# EAGLE design Esquematico (EAGLE 9.6.2)
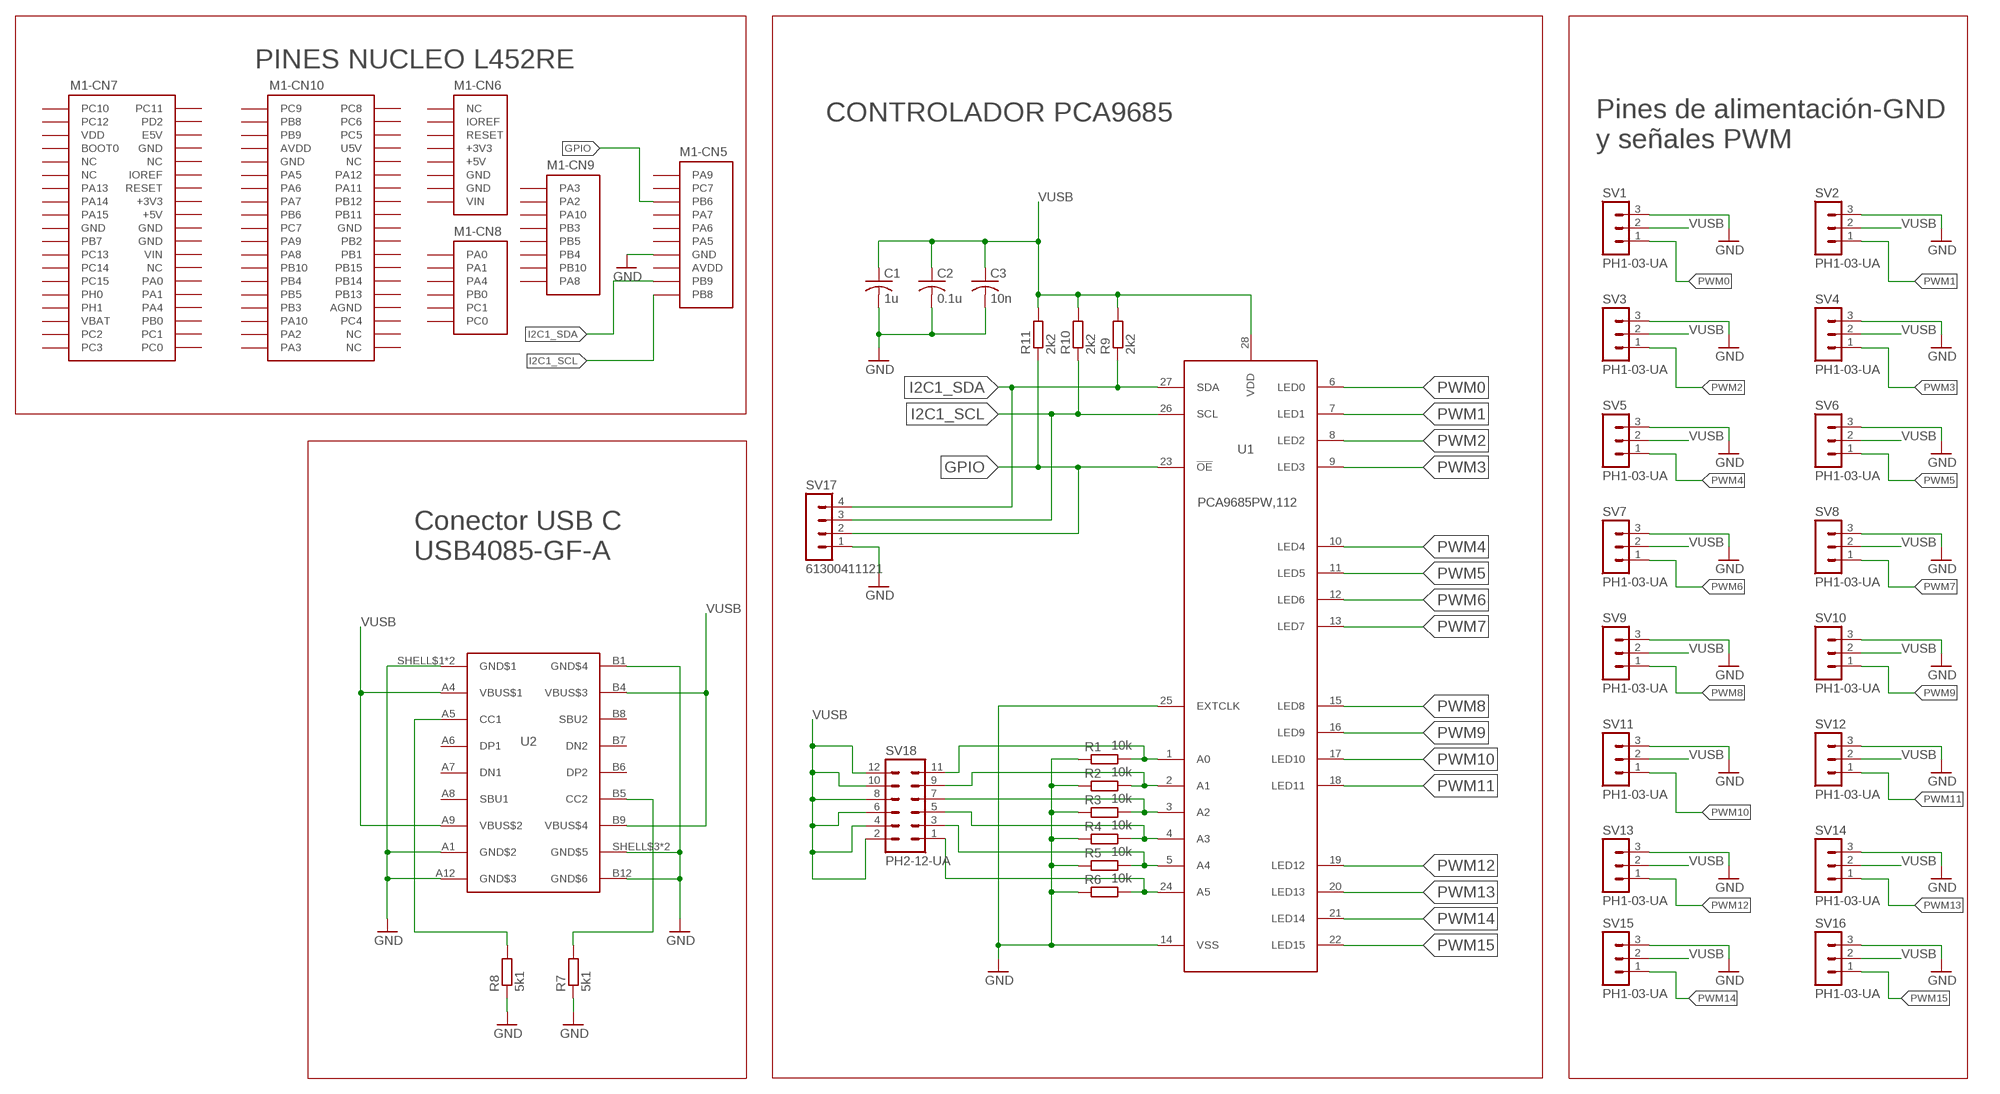
[diagram p0: schematic, sheet 1]

## Parts
C1  1u  C-USC1206  [C1206]
C2  0.1u  C-USC0805  [C0805]
C3  10n  C-USC0603  [C0603]
M1  NUCLEO-L452RE  [NUCLEO-64]
R1  10k  R-EU_R0805  [R0805]
R2  10k  R-EU_R0805  [R0805]
R3  10k  R-EU_R0805  [R0805]
R4  10k  R-EU_R0805  [R0805]
R5  10k  R-EU_R0805  [R0805]
R6  10k  R-EU_R0805  [R0805]
R7  5k1  R-EU_R0805  [R0805]
R8  5k1  R-EU_R0805  [R0805]
R9  2k2  R-EU_R0805  [R0805]
R10  2k2  R-EU_R0805  [R0805]
R11  2k2  R-EU_R0805  [R0805]
SV1  PH1-03-UA  MA03-1  [MA03-1]
SV2  PH1-03-UA  MA03-1  [MA03-1]
SV3  PH1-03-UA  MA03-1  [MA03-1]
SV4  PH1-03-UA  MA03-1  [MA03-1]
SV5  PH1-03-UA  MA03-1  [MA03-1]
SV6  PH1-03-UA  MA03-1  [MA03-1]
SV7  PH1-03-UA  MA03-1  [MA03-1]
SV8  PH1-03-UA  MA03-1  [MA03-1]
SV9  PH1-03-UA  MA03-1  [MA03-1]
SV10  PH1-03-UA  MA03-1  [MA03-1]
SV11  PH1-03-UA  MA03-1  [MA03-1]
SV12  PH1-03-UA  MA03-1  [MA03-1]
SV13  PH1-03-UA  MA03-1  [MA03-1]
SV14  PH1-03-UA  MA03-1  [MA03-1]
SV15  PH1-03-UA  MA03-1  [MA03-1]
SV16  PH1-03-UA  MA03-1  [MA03-1]
SV17  61300411121  MA04-1  [MA04-1]
SV18  PH2-12-UA  MA06-2  [MA06-2]
U1  PCA9685PW,112  [SOP65P640X110-28N]
U2  USB4085-GF-A  [TROUGH_HOLE]

## Nets
GND: C1.2 C2.2 C3.2 M1.CN5-7(-CN5:GND) R1.1 R2.1 R3.1 R4.1 R5.1 R6.1 R7.1 R8.1 SV1.3 SV2.3 SV3.3 SV4.3 SV5.3 SV6.3 SV7.3 SV8.3 SV9.3 SV10.3 SV11.3 SV12.3 SV13.3 SV14.3 SV15.3 SV16.3 SV17.1 U1.14(VSS) U1.25(EXTCLK) U2.A1(GND$2) U2.A12(GND$3) U2.B1(GND$4) U2.B12(GND$6) U2.SHELL$1(GND$1) U2.SHELL$2(GND$1) U2.SHELL$3(GND$5) U2.SHELL$4(GND$5)
GPIO: M1.CN5-3(-CN5:PB6) R11.1 SV17.2 U1.23(!OE)
I2C1_SCL: M1.CN5-10(-CN5:PB8) R10.1 SV17.3 U1.26(SCL)
I2C1_SDA: M1.CN5-9(-CN5:PB9) R9.1 SV17.4 U1.27(SDA)
N$1: R1.2 SV18.11 U1.1(A0)
N$2: R2.2 SV18.9 U1.2(A1)
N$3: R3.2 SV18.7 U1.3(A2)
N$4: R4.2 SV18.5 U1.4(A3)
N$5: R5.2 SV18.3 U1.5(A4)
N$6: R6.2 SV18.1 U1.24(A5)
N$7: R8.2 U2.A5(CC1)
N$9: R7.2 U2.B5(CC2)
PWM0: SV1.1 U1.6(LED0)
PWM1: SV2.1 U1.7(LED1)
PWM2: SV3.1 U1.8(LED2)
PWM3: SV4.1 U1.9(LED3)
PWM4: SV5.1 U1.10(LED4)
PWM5: SV6.1 U1.11(LED5)
PWM6: SV7.1 U1.12(LED6)
PWM7: SV8.1 U1.13(LED7)
PWM8: SV9.1 U1.15(LED8)
PWM9: SV10.1 U1.16(LED9)
PWM10: SV11.1 U1.17(LED10)
PWM11: SV12.1 U1.18(LED11)
PWM12: SV13.1 U1.19(LED12)
PWM13: SV14.1 U1.20(LED13)
PWM14: SV15.1 U1.21(LED14)
PWM15: SV16.1 U1.22(LED15)
VUSB: C1.1 C2.1 C3.1 R9.2 R10.2 R11.2 SV1.2 SV2.2 SV3.2 SV4.2 SV5.2 SV6.2 SV7.2 SV8.2 SV9.2 SV10.2 SV11.2 SV12.2 SV13.2 SV14.2 SV15.2 SV16.2 SV18.2 SV18.4 SV18.6 SV18.8 SV18.10 SV18.12 U1.28(VDD) U2.A4(VBUS$1) U2.A9(VBUS$2) U2.B4(VBUS$3) U2.B9(VBUS$4)
Unconnected: M1.CN5-1(-CN5:PA9) M1.CN5-2(-CN5:PC7) M1.CN5-4(-CN5:PA7) M1.CN5-5(-CN5:PA6) M1.CN5-6(-CN5:PA5) M1.CN6-1(-CN6:NC) M1.CN6-3(-CN6:RESET) M1.CN7-1(-CN7:PC10) M1.CN7-2(-CN7:PC11) M1.CN7-3(-CN7:PC12) M1.CN7-4(-CN7:PD2) M1.CN7-6(-CN7:E5V) M1.CN7-7(-CN7:BOOT0) M1.CN7-9(-CN7:NC) M1.CN7-10(-CN7:NC) M1.CN7-11(-CN7:NC) M1.CN7-12(-CN7:IOREF) M1.CN7-13(-CN7:PA13) M1.CN7-14(-CN7:RESET) M1.CN7-15(-CN7:PA14) M1.CN7-17(-CN7:PA15) M1.CN7-21(-CN7:PB7) M1.CN7-23(-CN7:PC13) M1.CN7-25(-CN7:PC14) M1.CN7-26(-CN7:NC) M1.CN7-27(-CN7:PC15) M1.CN7-28(-CN7:PA0) M1.CN7-29(-CN7:PH0) M1.CN7-30(-CN7:PA1) M1.CN7-31(-CN7:PH1) M1.CN7-32(-CN7:PA4) M1.CN7-34(-CN7:PB0) M1.CN7-35(-CN7:PC2) M1.CN7-36(-CN7:PC1) M1.CN7-37(-CN7:PC3) M1.CN7-38(-CN7:PC0) M1.CN8-1(-CN8:PA0) M1.CN8-2(-CN8:PA1) M1.CN8-3(-CN8:PA4) M1.CN8-4(-CN8:PB0) M1.CN8-5(-CN8:PC1) M1.CN8-6(-CN8:PC0) M1.CN9-1(-CN9:PA3) M1.CN9-2(-CN9:PA2) M1.CN9-3(-CN9:PA10) M1.CN9-4(-CN9:PB3) M1.CN9-5(-CN9:PB5) M1.CN9-6(-CN9:PB4) M1.CN9-7(-CN9:PB10) M1.CN9-8(-CN9:PA8) M1.CN10-1(-CN10:PC9) M1.CN10-2(-CN10:PC8) M1.CN10-3(-CN10:PB8) M1.CN10-4(-CN10:PC6) M1.CN10-5(-CN10:PB9) M1.CN10-6(-CN10:PC5) M1.CN10-10(-CN10:NC) M1.CN10-11(-CN10:PA5) M1.CN10-12(-CN10:PA12) M1.CN10-13(-CN10:PA6) M1.CN10-14(-CN10:PA11) M1.CN10-15(-CN10:PA7) M1.CN10-16(-CN10:PB12) M1.CN10-17(-CN10:PB6) M1.CN10-18(-CN10:PB11) M1.CN10-19(-CN10:PC7) M1.CN10-21(-CN10:PA9) M1.CN10-22(-CN10:PB2) M1.CN10-23(-CN10:PA8) M1.CN10-24(-CN10:PB1) M1.CN10-25(-CN10:PB10) M1.CN10-26(-CN10:PB15) M1.CN10-27(-CN10:PB4) M1.CN10-28(-CN10:PB14) M1.CN10-29(-CN10:PB5) M1.CN10-30(-CN10:PB13) M1.CN10-31(-CN10:PB3) M1.CN10-33(-CN10:PA10) M1.CN10-34(-CN10:PC4) M1.CN10-35(-CN10:PA2) M1.CN10-36(-CN10:NC) M1.CN10-37(-CN10:PA3) M1.CN10-38(-CN10:NC) U2.A6(DP1) U2.A7(DN1) U2.A8(SBU1) U2.B6(DP2) U2.B7(DN2) U2.B8(SBU2)

## Notes on the sheet
- PINES NUCLEO L452RE
- CONTROLADOR PCA9685
- Pines de alimentación-GND
  y señales PWM
- Conector USB C
  USB4085-GF-A

## Power pins joined to a net without a drawn wire
+3V3: M1.CN6-4(-CN6:+3V3) M1.CN7-16(-CN7:+3V3)
+5V: M1.CN6-5(-CN6:+5V) M1.CN7-18(-CN7:+5V)
AGND: M1.CN10-32(-CN10:AGND)
AVDD: M1.CN5-8(-CN5:AVDD) M1.CN10-7(-CN10:AVDD)
GND: M1.CN6-6(-CN6:GND) M1.CN6-7(-CN6:GND) M1.CN7-8(-CN7:GND) M1.CN7-19(-CN7:GND) M1.CN7-20(-CN7:GND) M1.CN7-22(-CN7:GND) M1.CN10-9(-CN10:GND) M1.CN10-20(-CN10:GND)
IOREF: M1.CN6-2(-CN6:IOREF)
U5V: M1.CN10-8(-CN10:U5V)
VBAT: M1.CN7-33(-CN7:VBAT)
VDD: M1.CN7-5(-CN7:VDD)
VIN: M1.CN6-8(-CN6:VIN) M1.CN7-24(-CN7:VIN)

## Library data of the parts
C1 = rcl:C-US: CAPACITOR, American symbol; PARTNO: 490-5810-1-ND; SPICEPREFIX: C
C2 = rcl:C-US: CAPACITOR, American symbol; PARTNO: 490-GCJ21BR72A104KA01KCT-ND; SPICEPREFIX: C
C3 = rcl:C-US: CAPACITOR, American symbol; PARTNO: 490-4781-1-ND; SPICEPREFIX: C
M1 = NUCLEO-L452RE:NUCLEO-L452RE: No existe un outline (Layer Dimension) para esta librería. En su lugar se utilizó una referencia en tDocu. Al momento de diseñar la tarjeta, el Dimension debe ser dibujado según los requerimientos del usuario, o simplemente copiar los contenidos del tDocu en Dimensions.; PARTNO: NUCLEO-L452RE
R1-R6 = rcl:R-EU_: RESISTOR, European symbol; PARTNO: 311-10KARCT-ND; SPICEPREFIX: R
R7 R8 = rcl:R-EU_: RESISTOR, European symbol; PARTNO: 311-5.10KCRCT-ND; SPICEPREFIX: R
R9-R11 = rcl:R-EU_: RESISTOR, European symbol; PARTNO: 311-2.2KARCT-ND; SPICEPREFIX: R
SV1-SV16 = con-lstb:MA03-1: PIN HEADER; OC_FARNELL: unknown; OC_NEWARK: unknown; PARTNO: PH1-03-UA
SV17 = con-lstb:MA04-1: PIN HEADER; OC_FARNELL: unknown; OC_NEWARK: unknown; PARTNO: 61300411121
SV18 = con-lstb:MA06-2: PIN HEADER; OC_FARNELL: unknown; OC_NEWARK: unknown; PARTNO: PH2-12-UA
U1 = PCA9685PW,112 - NXP USA Inc:PCA9685PW,112; PARTNO: PCA9685PW,112
U2 = USB4085-GF-A:USB4085-GF-A; PARTNO: 2073-USB4085-GF-ACT-ND

## Board
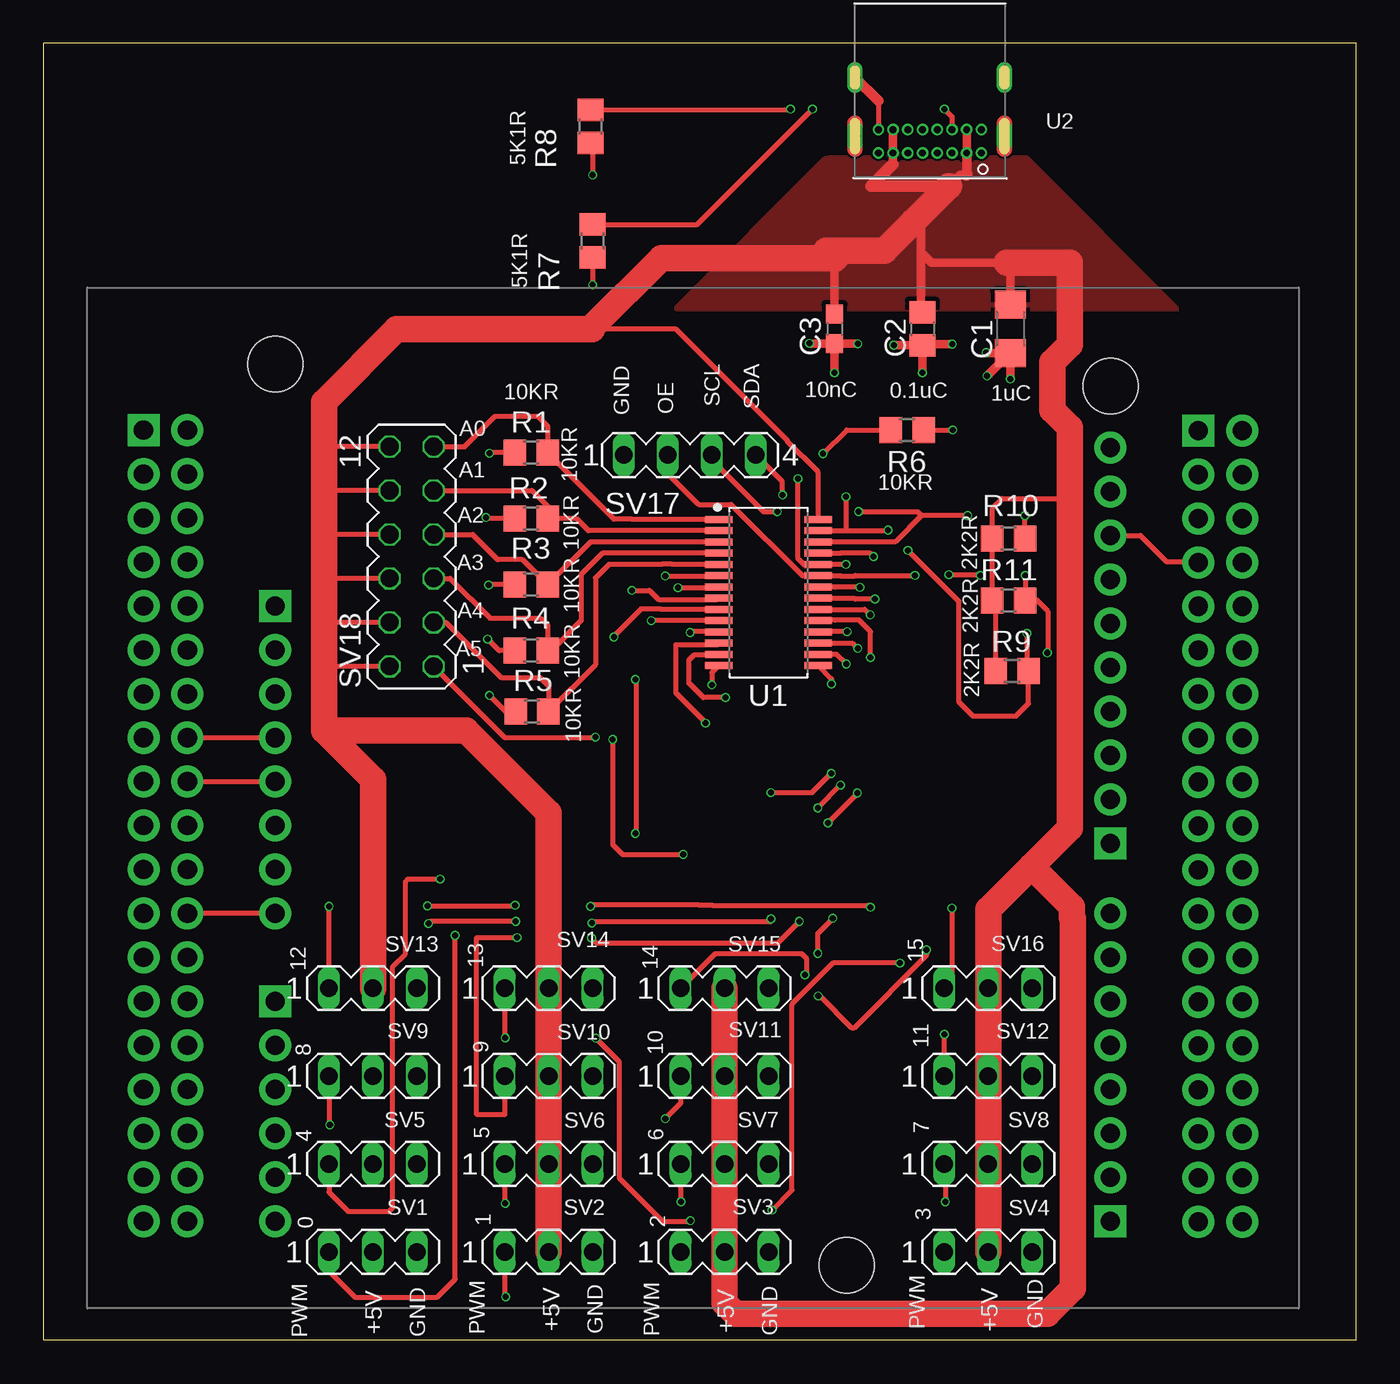
[diagram p1: board, top side]
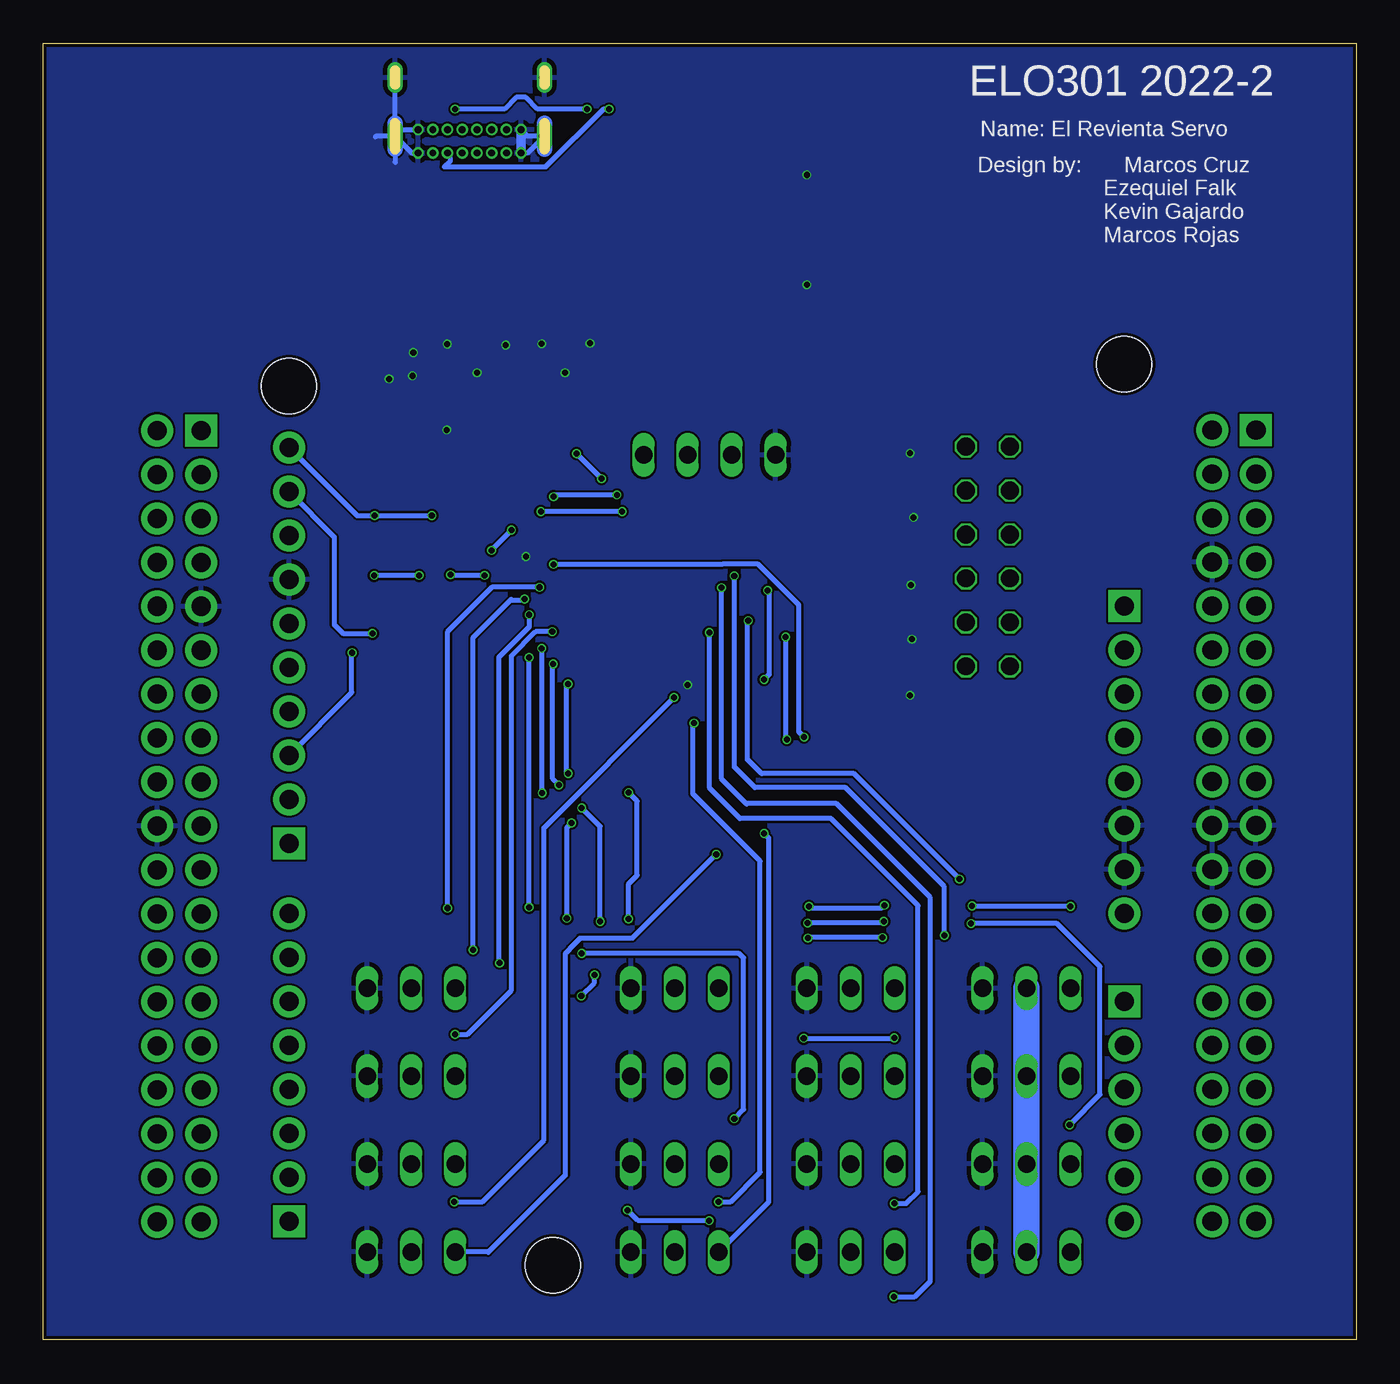
[diagram p2: board, bottom side, seen from below]

Size 75.87 x 74.92 mm. Coordinates in mm from the lower left corner, seen from the top.
Outline: 0,0 75.87,0 75.87,74.92 0,74.92 0,0
Copper layers (1*16): Top 0.035mm / dielectric 1.6mm / Bottom 0.035mm
Design rules "jlcpcb-2layers *": minimum track width 5mil, minimum drill 0.3mm, track to track 5mil, track to pad 0.2mm, pad to pad 5mil, via to via 10mil, smd to smd 5mil, copper to edge 0.2mm, drill to drill 6mil, minimum pad ring 0.13mm, minimum via ring 3mil, stop-mask expansion 4mil, vias tented up to drill 15mil, thermal gap 10mil

### Footprints (pad centres in the part's own frame; a part is rotated, then mirrored left to right if it is on the bottom)
C1206 = smd 1.6 x 1.8: 1 -1.4,0; 2 1.4,0
C0805 = smd 1.3 x 1.5: 1 -0.95,0; 2 0.95,0
C0603 = smd 1.1 x 1: 1 -0.85,0; 2 0.85,0
NUCLEO-64 = drill 1.1 pad 1.85 square: CN5-1 59.13,24.884; CN6-1 10.87,38.6; CN7-1 3.25,48.76; CN8-1 10.87,15.74; CN9-1 59.13,3.04; CN10-1 64.21,48.735 | drill 1.1 pad 1.85: CN5-2 59.13,27.424; CN5-3 59.13,29.964; CN5-4 59.13,32.504; CN5-5 59.13,35.044; CN5-6 59.13,37.584; CN5-7 59.13,40.124; CN5-8 59.13,42.664; CN5-9 59.13,45.204; CN5-10 59.13,47.744; CN6-2 10.87,36.06; CN6-3 10.87,33.52; CN6-4 10.87,30.98; CN6-5 10.87,28.44; CN6-6 10.87,25.9; CN6-7 10.87,23.36; CN6-8 10.87,20.82; CN7-2 5.79,48.76; CN7-3 3.25,46.22; CN7-4 5.79,46.22; CN7-5 3.25,43.68; CN7-6 5.79,43.68; CN7-7 3.25,41.14; CN7-8 5.79,41.14; CN7-9 3.25,38.6; CN7-10 5.79,38.6; CN7-11 3.25,36.06; CN7-12 5.79,36.06; CN7-13 3.25,33.52; CN7-14 5.79,33.52; CN7-15 3.25,30.98; CN7-16 5.79,30.98; CN7-17 3.25,28.44; CN7-18 5.79,28.44; CN7-19 3.25,25.9; CN7-20 5.79,25.9; CN7-21 3.25,23.36; CN7-22 5.79,23.36; CN7-23 3.25,20.82; CN7-24 5.79,20.82; CN7-25 3.25,18.28; CN7-26 5.79,18.28; CN7-27 3.25,15.74; CN7-28 5.79,15.74; CN7-29 3.25,13.2; CN7-30 5.79,13.2; CN7-31 3.25,10.66; CN7-32 5.79,10.66; CN7-33 3.25,8.12; CN7-34 5.79,8.12; CN7-35 3.25,5.58; CN7-36 5.79,5.58; CN7-37 3.25,3.04; CN7-38 5.79,3.04; CN8-2 10.87,13.2; CN8-3 10.87,10.66; CN8-4 10.87,8.12; CN8-5 10.87,5.58; CN8-6 10.87,3.04; CN9-2 59.13,5.58; CN9-3 59.13,8.12; CN9-4 59.13,10.66; CN9-5 59.13,13.2; CN9-6 59.13,15.74; CN9-7 59.13,18.28; CN9-8 59.13,20.82; CN10-2 66.75,48.735; CN10-3 64.21,46.195; CN10-4 66.75,46.195; CN10-5 64.21,43.655; CN10-6 66.75,43.655; CN10-7 64.21,41.115; CN10-8 66.75,41.115; CN10-9 64.21,38.575; CN10-10 66.75,38.575; CN10-11 64.21,36.035; CN10-12 66.75,36.035; CN10-13 64.21,33.495; CN10-14 66.75,33.495; CN10-15 64.21,30.955; CN10-16 66.75,30.955; CN10-17 64.21,28.415; CN10-18 66.75,28.415; CN10-19 64.21,25.875; CN10-20 66.75,25.875; CN10-21 64.21,23.335; CN10-22 66.75,23.335; CN10-23 64.21,20.795; CN10-24 66.75,20.795; CN10-25 64.21,18.255; CN10-26 66.75,18.255; CN10-27 64.21,15.715; CN10-28 66.75,15.715; CN10-29 64.21,13.175; CN10-30 66.75,13.175; CN10-31 64.21,10.635; CN10-32 66.75,10.635; CN10-33 64.21,8.095; CN10-34 66.75,8.095; CN10-35 64.21,5.555; CN10-36 66.75,5.555; CN10-37 64.21,3.015; CN10-38 66.75,3.015 | hole 3.175: 59.13,51.3; 10.87,52.57; 43.89,0.5
R0805 = smd 1.3 x 1.5: 1 -0.95,0; 2 0.95,0
MA03-1 = drill 1.016 long: 1 -2.54,0; 2 0,0; 3 2.54,0
MA04-1 = drill 1.016 long: 1 -3.81,0; 2 -1.27,0; 3 1.27,0; 4 3.81,0
MA06-2 = drill 1.016 octagon: 1 -6.35,-1.27; 2 -6.35,1.27; 3 -3.81,-1.27; 4 -3.81,1.27; 5 -1.27,-1.27; 6 -1.27,1.27; 7 1.27,-1.27; 8 1.27,1.27; 9 3.81,-1.27; 10 3.81,1.27; 11 6.35,-1.27; 12 6.35,1.27
SOP65P640X110-28N = smd 1.572 x 0.407: 1 -2.872,4.225; 2 -2.872,3.575; 3 -2.872,2.925; 4 -2.872,2.275; 5 -2.872,1.625; 6 -2.872,0.975; 7 -2.872,0.325; 8 -2.872,-0.325; 9 -2.872,-0.975; 10 -2.872,-1.625; 11 -2.872,-2.275; 12 -2.872,-2.925; 13 -2.872,-3.575; 14 -2.872,-4.225; 15 2.872,-4.225; 16 2.872,-3.575; 17 2.872,-2.925; 18 2.872,-2.275; 19 2.872,-1.625; 20 2.872,-0.975; 21 2.872,-0.325; 22 2.872,0.325; 23 2.872,0.975; 24 2.872,1.625; 25 2.872,2.275; 26 2.872,2.925; 27 2.872,3.575; 28 2.872,4.225
TROUGH_HOLE = drill 0.4 pad 0.65: A1 5.95,0; A4 5.1,0; A5 4.25,0; A6 3.4,0; A7 2.55,0; A8 1.7,0; A9 0.85,0; A12 0,0; B1 5.95,1.35; B4 5.1,1.35; B5 4.25,1.35; B6 3.4,1.35; B7 2.55,1.35; B8 1.7,1.35; B9 0.85,1.35; B12 0,1.35 | drill 0.6 pad 0.9 long: SHELL$1 -1.35,0.98; SHELL$2 7.28,0.98; SHELL$3 -1.35,4.36; SHELL$4 7.28,4.36

### Placement (x,y rotation side)
C1  55.88,58.42 270 top
C2  50.8,58.42 270 top
C3  45.72,58.42 270 top
M1  2.54,3.81 0 top
R1  28.19,51.26 0 top
R2  28.19,47.45 0 top
R3  28.19,43.64 0 top
R4  28.19,39.83 0 top
R5  28.24,36.3 0 top
R6  49.91,52.58 180 top
R7  31.75,63.5 90 top
R8  31.62,70.1 90 top
R9  55.98,38.63 180 top
R10  55.78,46.3 180 top
R11  55.78,42.72 180 top
SV1  19.05,5.08 0 top
SV2  29.21,5.08 0 top
SV3  39.37,5.08 0 top
SV4  54.61,5.08 0 top
SV5  19.05,10.16 0 top
SV6  29.21,10.16 0 top
SV7  39.37,10.16 0 top
SV8  54.61,10.16 0 top
SV9  19.05,15.24 0 top
SV10  29.21,15.24 0 top
SV11  39.37,15.24 0 top
SV12  54.61,15.24 0 top
SV13  19.05,20.32 0 top
SV14  29.21,20.32 0 top
SV15  39.37,20.32 0 top
SV16  54.61,20.32 0 top
SV17  37.36,51.13 0 top
SV18  21.29,45.26 90 top
U1  41.91,43.18 0 top
U2  48.26,68.58 0 top

### Tracks (layer width: path | path; a pad name or v marks a point on that pad's centre or on a via)
+3V3
  Top 0.3: M1.CN7-16 M1.CN6-4
+5V
  Top 0.3: M1.CN7-18 M1.CN6-5
AVDD
  Top 0.3: M1.CN5-8 63.4,46.47 64.92,44.95 66.73,44.95 M1.CN10-7
GND  (via drill 0.35)
  Top 0.3: U1.25 46.07,45.45 46.1,45.49 47.76,45.49 v47.98,45.26 | U1.14 38.63,38.55 v38.63,37.85 | R6.1 v52.55,52.58 | R1.1 25.81,51.26 v25.78,51.23 | R2.1 25.65,47.45 v25.58,47.52 | R3.1 25.76,43.64 v25.73,43.61 | R4.1 26.34,39.83 v25.68,40.49 | R5.1 26.72,36.3 v25.78,37.24 | R8.1 31.75,69.03 v31.75,67.31 | R7.1 v31.75,60.96 | 48.26,71.59 U2.B12
  Top 0.5: C3.2 v45.72,55.88 | C2.2 v50.8,55.88 | C1.2 v55.88,55.52 | C3.2 44.28,57.57 v44.27,57.58 | C3.2 47.05,57.57 v47.07,57.56 | C2.2 v49.16,57.47 v49.15,57.48 | C2.2 50.86,57.53 v52.53,57.53 | C1.2 54.51,57.02 v54.48,57.05 | C1.2 54.56,55.7 v54.53,55.7
  Top 0.6: U2.SHELL$3 48.26,71.59
  Bottom 0.3: 55.52,68.05 55.54,68.06 U2.SHELL$2 | U2.B12 47.89,69.56 U2.SHELL$1 47.89,68.58 U2.A12 | U2.SHELL$2 56.63,69.56 56.69,69.49 | U2.SHELL$2 U2.SHELL$4 | U2.SHELL$2 55.17,69.93 U2.B1 | U2.SHELL$2 54.56,68.58 U2.A1
  Bottom 0.55: U2.B12 U2.A12
  pour Bottom: 0,74.93 0,-0.05 76.2,-0.05 76.2,74.93
GPIO  (via drill 0.35)
  Top 0.3: v50.37,44.17 v50.36,44.16 46.91,44.16 46.87,44.12 46.1,44.12 46.07,44.16 U1.23 43.86,44.16 39.75,48.27 37.86,48.27 36.09,50.04 SV17.2 | v52.33,44.21 54.12,44.21 v54.15,44.17 | v56.74,44.17 56.74,42.74 R11.1 56.78,42.77 57.38,42.77 58.04,42.11 58.04,39.72 v58.02,39.7
  Bottom 0.3: v50.37,44.17 52.3,44.17 v52.33,44.21 | v54.15,44.17 v56.74,44.17 | M1.CN5-3 58.04,37.41 58.04,39.68 v58.02,39.7
I2C1_SCL  (via drill 0.35)
  Top 0.3: R10.1 v56.73,47.62 v56.72,47.62 | v53.42,47.62 50.75,47.62 | U1.26 49.23,46.11 50.75,47.62 | SV17.3 38.63,50.83 41.61,47.85 v42.42,47.85 | v47.12,47.85 50.52,47.85 50.75,47.62
  Bottom 0.3: v53.42,47.62 v56.72,47.62 57.74,47.62 M1.CN5-10 | v42.42,47.85 v47.12,47.85
I2C1_SDA  (via drill 0.35)
  Top 0.3: U1.27 46.36,46.76 | 46.36,46.76 48.77,46.76 48.82,46.71 v48.82,46.79 | v49.96,45.62 52.88,42.7 52.88,36.88 53.72,36.04 56.21,36.04 56.93,36.76 R9.1 56.84,38.72 v56.84,40.82 | SV17.4 42.67,49.63 42.67,48.82 v42.72,48.82 | v46.38,48.72 46.38,46.78 46.36,46.76
  Bottom 0.3: v48.82,46.79 49.96,45.64 v49.96,45.62 | v42.72,48.82 46.28,48.82 v46.38,48.72 | M1.CN5-9 59.06,46.4 59.06,41.33 58.55,40.82 v56.84,40.82
N$1
  Top 0.3: U1.1 34.01,47.41 34.01,47.42 32.98,47.42 R1.2 29.14,52.8 28.57,53.37 26.09,53.37 26.09,53.34 24.36,51.61 SV18.11
N$2
  Top 0.3: U1.2 31.5,46.76 30.81,47.45 29.46,47.45 | 29.46,47.45 R2.2 | SV18.9 28.25,49.07 29.46,47.85 29.46,47.45
N$3
  Top 0.3: U1.3 31.63,46.11 29.15,43.63 R3.2 27.7,45.09 26.26,45.09 24.82,46.53 SV18.7
N$4
  Top 0.3: U1.4 32.32,45.45 31.09,44.22 31.09,41.55 29.36,39.83 R4.2 29.14,41.29 28.73,41.71 25.81,41.71 23.52,43.99 SV18.5
N$5
  Top 0.3: U1.5 36.34,44.8 36.33,44.83 35.76,44.83 35.74,44.81 32.69,44.81 31.9,44.02 31.9,39 R5.2 29.19,37.79 28.7,38.28 26.44,38.28 23.27,41.45 SV18.3
N$6  (via drill 0.35)
  Top 0.3: SV18.1 26.67,34.8 31.88,34.8 v31.9,34.82 | v46.38,44.81 U1.24 43.95,44.8 43.61,45.13 v43.61,49.76 | v45.06,51.21 46.43,52.58 R6.2
  Bottom 0.3: v31.9,34.82 32.21,35.13 32.21,42.47 34.57,44.83 36.63,44.83 36.65,44.81 v46.38,44.81 | v43.61,49.76 v45.06,51.21
N$7  (via drill 0.35)
  Top 0.3: v43.18,71.12 43.11,71.05 R8.2
  Bottom 0.3: v43.18,71.12 43.49,71.12 46.83,67.78 52.69,67.78 52.34,68.13 52.34,68.25 52.37,68.29 52.37,68.44 U2.A5
N$9  (via drill 0.35)
  Top 0.3: v52.07,71.12 52.51,70.68 U2.B5 | R7.2 37.78,64.45 v44.45,71.12
  Bottom 0.3: v44.45,71.12 47.3,71.12 47.98,71.8 48.54,71.8 49.22,71.12 v52.07,71.12
PWM0  (via drill 0.35)
  Top 0.3: v35.94,44.15 39.03,44.15 U1.6 | SV1.1 16.51,3.96 18.01,2.46 22.76,2.46 23.8,3.51 v23.8,23.37
  Bottom 0.3: v35.94,44.15 35.94,33.1 34.75,31.9 29.51,31.9 23.8,26.19 v23.8,23.37
PWM1  (via drill 0.35)
  Top 0.3: SV2.1 26.67,2.54 v26.72,2.49 | v36.68,43.46 38.99,43.46 U1.7
  Bottom 0.3: v26.72,2.49 25.5,2.49 24.61,3.38 24.61,25.55 30.05,30.99 35.2,30.99 35.23,30.96 36.68,32.41 v36.68,43.46
PWM2  (via drill 0.35)
  Top 0.3: v34.21,38.15 34.27,38.1 34.27,29.31 v34.21,29.26 | v34.01,43.31 35.03,43.31 35.56,42.78 38.96,42.78 U1.8
  Bottom 0.3: v34.21,29.26 33.96,29.01 33.96,7.95 SV3.1 | v34.01,43.31 33.93,43.23 33.93,38.43 v34.21,38.15
PWM3  (via drill 0.35)
  Top 0.3: U1.9 35.67,42.2 35.64,42.23 34.54,42.23 32.97,40.67 v32.97,40.62 | v32.91,34.68 32.91,28.61 33.48,28.04 v36.98,28.04
  Bottom 0.3: v32.97,40.62 32.97,34.75 v32.91,34.68 | v36.98,28.04 41.81,23.22 44.86,23.22 44.86,23.19 45.44,22.61 45.44,22.59 45.69,22.33 45.69,9.53 50.17,5.05 50.19,5.08 SV4.1
PWM4  (via drill 0.35)
  Top 0.3: SV5.1 16.51,8.53 17.63,7.42 17.65,7.42 19.99,7.42 20.2,7.63 20.2,21.57 20.93,22.3 20.93,26.47 21.08,26.62 v22.94,26.62 | v35.13,41.55 U1.10
  Bottom 0.3: v22.94,26.62 29.03,32.72 34.37,32.72 35.18,33.53 35.18,41.55 v35.13,41.55
PWM5  (via drill 0.35)
  Top 0.3: SV6.1 26.67,7.9 v26.69,7.87 | v37.38,40.87 37.44,40.93 39.01,40.93 U1.11
  Bottom 0.3: v26.69,7.87 26.01,7.87 25.32,8.56 25.32,25.09 30.33,30.1 30.33,30.12 35.61,30.12 37.36,31.88 37.36,40.87 v37.38,40.87
PWM6  (via drill 0.35)
  Top 0.3: SV7.1 36.83,8 v36.86,7.98 | v38.27,35.64 38.27,35.67 36.55,37.39 36.55,40.16 38.95,40.16 U1.12
  Bottom 0.3: v36.86,7.98 36.14,7.98 34.44,9.68 34.44,27.66 38.33,31.55 38.33,35.58 v38.27,35.64
PWM7  (via drill 0.35)
  Top 0.3: SV8.1 52.12,10.11 v52.12,7.98 | v39.42,37.11 38.15,37.11 37.31,37.95 37.31,39.27 37.64,39.6 U1.13
  Bottom 0.3: v52.12,7.98 50.5,7.98 46.94,11.53 46.94,29.59 v39.42,37.11
PWM8  (via drill 0.35)
  Top 0.3: SV9.1 16.51,12.47 v16.56,12.42 | v27.3,24.18 22.38,24.18 v22.26,24.05 | v42.05,24.32 42.05,24.16 31.78,24.16 v31.7,24.08 | v42.04,31.62 44.42,31.62 v45.52,32.72 v45.53,32.72 | v45.55,37.9 45.55,38.19 U1.15
  Bottom 0.3: v16.56,12.42 14.81,14.17 14.81,21.56 17.3,24.05 v22.26,24.05 | v27.3,24.18 27.38,24.1 31.48,24.1 31.5,24.08 v31.7,24.08 | v42.05,24.32 42.05,26.35 41.55,26.84 41.55,31.13 v42.04,31.62 | v45.53,32.72 45.62,32.81 45.62,37.9 v45.55,37.9
PWM9  (via drill 0.35)
  Top 0.3: SV10.1 26.67,13.01 25.04,13.01 25.04,23.24 v27.38,23.24 | v31.68,23.22 31.98,22.92 42.42,22.92 v43.69,24.18 | v44.75,30.73 v46.08,32.05 | v46.41,39.05 45.85,39.61 U1.16
  Bottom 0.3: v31.68,23.22 31.63,23.27 27.41,23.27 v27.38,23.24 | v43.69,24.18 43.69,29.67 v44.75,30.73 | v46.08,32.05 46.43,32.41 46.43,39.02 v46.41,39.05
PWM10  (via drill 0.35)
  Top 0.3: SV11.1 36.83,13.67 v35.94,12.78 | v44.75,22.33 44.75,23.49 v45.62,24.36 | U1.17 44.8,40.23 46.79,40.23 v47.07,39.95 | v47.04,31.6 47.04,31.57 v45.34,29.87
  Bottom 0.3: v45.34,29.87 45.62,29.59 v45.62,24.36 | v47.04,31.6 47.09,31.6 47.09,39.93 v47.07,39.95 | v35.94,12.78 35.41,13.31 35.41,22.07 35.66,22.33 v44.75,22.33
PWM11  (via drill 0.35)
  Top 0.3: SV12.1 v52.07,17.65 | v46.46,40.92 44.8,40.92 U1.18
  Bottom 0.3: v52.07,17.65 51.36,17.65 48.82,20.19 48.82,39.52 47.42,40.92 v46.46,40.92
PWM12  (via drill 0.35)
  Top 0.3: SV13.1 v16.51,25.04 | v22.2,25.07 27.23,25.07 v27.27,25.11 | v31.63,25.04 31.7,25.12 37.9,25.12 38.64,25.12 38.65,25.11 47.69,25.11 v47.8,24.99 | v47.8,39.42 47.8,40.92 47.12,41.6 45.79,41.6 45.77,41.58 44.81,41.58 U1.19
  Bottom 0.3: v16.51,25.04 22.17,25.04 v22.2,25.07 | v27.27,25.11 27.41,24.97 31.63,24.97 v31.63,25.04 | v47.8,24.99 v47.8,39.42
PWM13  (via drill 0.35)
  Top 0.3: U1.20 47.48,42.2 v47.79,41.9 | v49.5,21.77 45.64,21.77 43.28,19.41 43.28,8.66 v42.11,7.49 | v31.93,17.42 33.27,16.08 33.27,9.35 35.79,6.83 37.34,6.83 v37.39,6.88 | v26.69,17.45 26.69,20.3 SV14.1
  Bottom 0.3: v47.79,41.9 47.79,41.19 49.55,39.43 49.55,21.82 v49.5,21.77 | v31.93,17.42 v31.92,17.42 26.73,17.42 v26.69,17.45 | v37.39,6.88 37.41,6.91 41.53,6.91 v42.11,7.49
PWM14  (via drill 0.35)
  Top 0.3: v51.03,22.53 51.03,22.2 46.84,18.01 46.74,18.01 44.88,19.86 v44.78,19.86 | v48.06,42.8 46.91,42.8 46.89,42.82 44.81,42.82 U1.21 | SV15.1 38.84,22.33 43.81,22.33 44.09,22.05 44.09,21.08 v44.02,21.08
  Bottom 0.3: v51.03,22.53 51.03,40.59 48.82,42.8 48.82,42.75 48.11,42.75 v48.06,42.8 | v44.78,19.86 44.02,20.62 v44.02,21.08
PWM15  (via drill 0.35)
  Top 0.3: SV16.1 52.5,20.75 v52.5,24.94 | v47.19,43.48 47.17,43.51 45.75,43.51 45.77,43.48 44.8,43.48 U1.22
  Bottom 0.3: v52.5,24.94 52.5,40.92 49.94,43.48 v47.19,43.48
VIN
  Top 0.3: M1.CN6-8 M1.CN7-24
VUSB
  Top 0.3: R9.2 55.03,42.52 R11.2 54.83,43.89 54.83,44.45 R10.2 54.83,48.02 55.42,48.62 59.31,48.62 | SV18.12 16.31,51.61 16.23,51.54 | SV18.10 16.26,49.07 16.23,49.05 | SV18.8 16.26,46.53 16.23,46.56 | SV18.6 16.31,43.99 16.23,43.92 | SV18.4 16.33,41.45 16.23,41.35 | SV18.2 16.48,38.91 16.23,38.66 | U1.28 44.78,50.14 42.98,51.94 42.98,51.99 36.58,58.4 31.72,58.4
  Top 0.5: 55.91,62.13 55.88,62.11 C1.1 55.88,61.7 55.35,62.23 | 50.8,59.74 C2.1 50.72,59.45 50.72,62.84 | U2.B9 U2.A9 49.11,67.93 | U2.B4 U2.A4 | 53.36,67.33 53,67.33 52.32,66.65 | 50.28,64.61 50.72,64.16 50.72,62.84 | 50.72,62.84 51.33,62.23 55.35,62.23 | 55.35,62.23 55.67,62.23 | C3.1 45.72,62.48
  Top 0.55: U2.A4 53.36,67.33
  Top 0.65: 53.34,67.31 53.36,67.33 | 49.11,67.93 47.83,66.65 52.32,66.65
  Top 1.523: 16.23,35.2 16.23,38.66 16.23,41.35 16.23,43.92 16.23,46.56 16.23,49.05 16.23,51.54 16.23,54.2 20.43,58.4 31.72,58.4 31.72,58.52 35.71,62.51 45.77,62.51 45.72,62.46 45.72,62.48 45.26,62.94 48.62,62.94 50.28,64.61 52.32,66.65 | 16.23,35.2 19.05,32.39 SV13.2 | 16.23,35.2 24.43,35.2 29.21,30.43 SV14.2 SV10.2 SV6.2 SV2.2 | 57.1,27.36 54.61,24.87 SV16.2 SV12.2 SV8.2 SV4.2 | 57.1,27.36 59.31,29.57 59.31,48.62 59.31,52.71 58.31,53.72 58.31,56.5 59.31,57.51 59.31,62.23 55.67,62.23 | 57.1,27.36 59.44,25.02 59.44,24.41 59.49,24.36 59.49,2.97 58.01,1.5 40.01,1.5 39.37,2.13 SV3.2 SV7.2 SV11.2 SV15.2
  Bottom 1.523: SV13.2 SV9.2 SV5.2 SV1.2
  pour Top: 45.39,68.3 56.82,68.3 65.53,59.56 36.6,59.56 36.55,59.61 45.21,68.28 45.34,68.28

### Text on the board
tPlace: 5K1R | 5K1R | 10KR | OE | 10nC | 0.1uC | 1uC | GND | SCL | SDA | 10KR | A0 | A1 | 10KR | 10KR | 2K2R | A2 | A3 | 10KR | 2K2R | A4 | 10KR | A5 | 2K2R | 10KR | 13 | 15 | 12 | 14 | 9 | 10 | 11 | 8 | 4 | 5 | 6 | 7 | 0 | 1 | 2 | 3 | PWM | PWM | PWM | PWM | +5V | +5V | GND | +5V | GND | GND | +5V | GND
bPlace: ELO301 2022-2 | Name: El Revienta Servo | Design by: Marcos Cruz / Ezequiel Falk / Kevin Gajardo / Marcos Rojas